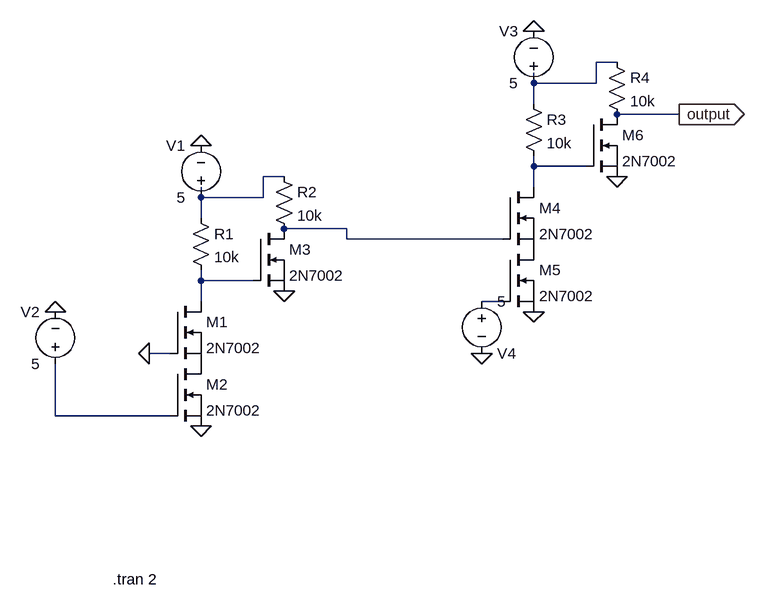
[diagram p0: schematic AND Gate Test.asc]
AND Gate Test.asc, the LTspice schematic file:
Version 4
SHEET 1 1064 680
WIRE 832 -304 800 -304
WIRE 704 -272 704 -288
WIRE 800 -272 800 -304
WIRE 800 -272 704 -272
WIRE 704 -240 704 -272
WIRE 928 -224 832 -224
WIRE 704 -144 704 -160
WIRE 784 -144 704 -144
WIRE 320 -128 288 -128
WIRE 704 -112 704 -144
WIRE 192 -96 192 -112
WIRE 288 -96 288 -128
WIRE 288 -96 192 -96
WIRE 192 -64 192 -96
WIRE 416 -48 320 -48
WIRE 416 -32 416 -48
WIRE 656 -32 416 -32
WIRE 192 32 192 16
WIRE 272 32 192 32
WIRE 192 64 192 32
WIRE 656 64 624 64
WIRE 144 144 112 144
WIRE -32 240 -32 160
WIRE 144 240 -32 240
FLAG 192 -176 0
FLAG -32 80 0
FLAG 192 256 0
FLAG 320 48 0
FLAG 704 -352 0
FLAG 928 -224 output
IOPIN 928 -224 Out
FLAG 704 80 0
FLAG 832 -128 0
FLAG 624 144 0
FLAG 112 144 0
SYMBOL nmos 144 64 R0
SYMATTR InstName M1
SYMATTR Value 2N7002
SYMBOL voltage 192 -80 R180
WINDOW 0 24 96 Left 2
WINDOW 3 24 16 Left 2
WINDOW 123 0 0 Left 0
WINDOW 39 0 0 Left 0
SYMATTR InstName V1
SYMATTR Value 5
SYMBOL nmos 144 160 R0
SYMATTR InstName M2
SYMATTR Value 2N7002
SYMBOL voltage -32 176 R180
WINDOW 0 24 96 Left 2
WINDOW 3 24 16 Left 2
WINDOW 123 0 0 Left 0
WINDOW 39 0 0 Left 0
SYMATTR InstName V2
SYMATTR Value 5
SYMBOL res 176 -80 R0
SYMATTR InstName R1
SYMATTR Value 10k
SYMBOL res 304 -144 R0
SYMATTR InstName R2
SYMATTR Value 10k
SYMBOL nmos 272 -48 R0
SYMATTR InstName M3
SYMATTR Value 2N7002
SYMBOL nmos 656 -112 R0
SYMATTR InstName M4
SYMATTR Value 2N7002
SYMBOL voltage 704 -256 R180
WINDOW 0 24 96 Left 2
WINDOW 3 24 16 Left 2
WINDOW 123 0 0 Left 0
WINDOW 39 0 0 Left 0
SYMATTR InstName V3
SYMATTR Value 5
SYMBOL nmos 656 -16 R0
SYMATTR InstName M5
SYMATTR Value 2N7002
SYMBOL res 688 -256 R0
SYMATTR InstName R3
SYMATTR Value 10k
SYMBOL res 816 -320 R0
SYMATTR InstName R4
SYMATTR Value 10k
SYMBOL nmos 784 -224 R0
SYMATTR InstName M6
SYMATTR Value 2N7002
SYMBOL voltage 624 48 R0
WINDOW 0 24 96 Left 2
WINDOW 3 24 16 Left 2
WINDOW 123 0 0 Left 0
WINDOW 39 0 0 Left 0
SYMATTR InstName V4
SYMATTR Value 5
TEXT 56 492 Left 2 !.tran 2

The netlist it stands for:
* AND Gate Test.asc
M1 N005 0 P001 P001 2N7002
V1 N003 0 5
M2 P001 N007 0 0 2N7002
V2 N007 0 5
R1 N003 N005 10k
R2 N003 N004 10k
M3 N004 N005 0 0 2N7002
M4 N002 N004 P002 P002 2N7002
V3 N001 0 5
M5 P002 N006 0 0 2N7002
R3 N001 N002 10k
R4 N001 output 10k
M6 output N002 0 0 2N7002
V4 N006 0 5
.model NMOS NMOS
.model PMOS PMOS
.lib standard.mos
.tran 2
.backanno
.end